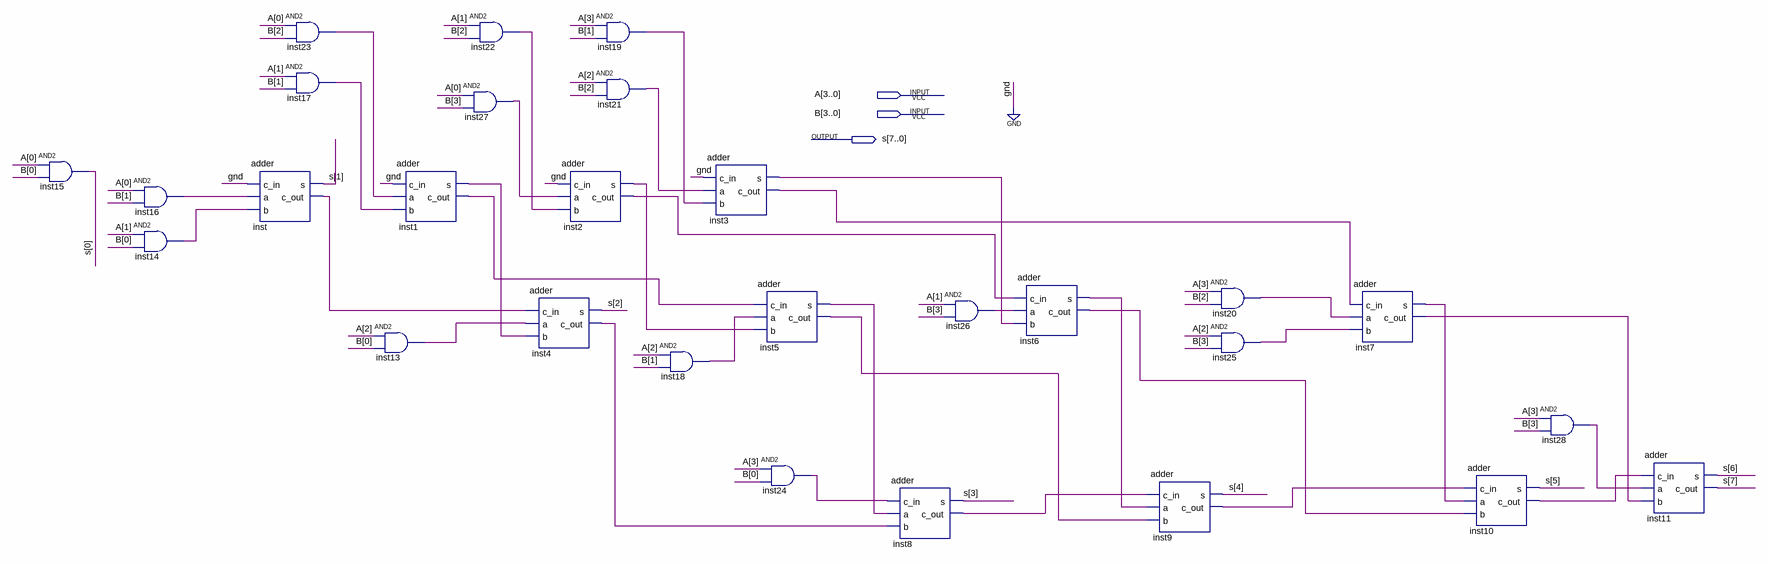
[diagram p0: schematic sheet]
// Quartus schematic multiplier.bdf as structural Verilog: 28 symbols, 3 pins
module multiplier (
  input  [3:0] A,
  input  [3:0] B,
  output [7:0] s
);

  wire inst1_c_out, inst1_s, inst2_c_out, inst2_s, inst3_c_out, inst3_s, inst4_c_out, inst5_c_out, inst5_s,
       inst6_c_out, inst6_s, inst7_c_out, inst7_s, inst8_c_out, inst9_c_out, inst10_c_out, inst13_out,
       inst14_out, inst16_out, inst17_out, inst18_out, inst19_out, inst20_out, inst21_out, inst22_out,
       inst23_out, inst24_out, inst25_out, inst26_out, inst27_out, inst28_out, inst_c_out;

  and inst15 (s[0], A[0], B[0]);
  and inst16 (inst16_out, A[0], B[1]);
  and inst14 (inst14_out, A[1], B[0]);
  adder inst (.c_in(1'b0), .a(inst16_out), .b(inst14_out), .s(s[1]), .c_out(inst_c_out));
  and inst23 (inst23_out, A[0], B[2]);
  and inst17 (inst17_out, A[1], B[1]);
  adder inst1 (.c_in(1'b0), .a(inst23_out), .b(inst17_out), .s(inst1_s), .c_out(inst1_c_out));
  and inst13 (inst13_out, A[2], B[0]);
  and inst22 (inst22_out, A[1], B[2]);
  and inst27 (inst27_out, A[0], B[3]);
  adder inst2 (.c_in(1'b0), .a(inst27_out), .b(inst22_out), .s(inst2_s), .c_out(inst2_c_out));
  adder inst4 (.c_in(inst_c_out), .a(inst13_out), .b(inst1_s), .s(s[2]), .c_out(inst4_c_out));
  and inst19 (inst19_out, A[3], B[1]);
  and inst21 (inst21_out, A[2], B[2]);
  and inst18 (inst18_out, A[2], B[1]);
  adder inst3 (.c_in(1'b0), .a(inst21_out), .b(inst19_out), .s(inst3_s), .c_out(inst3_c_out));
  adder inst5 (.c_in(inst1_c_out), .a(inst18_out), .b(inst2_s), .s(inst5_s), .c_out(inst5_c_out));
  and inst24 (inst24_out, A[3], B[0]);
  adder inst8 (.c_in(inst24_out), .a(inst5_s), .b(inst4_c_out), .s(s[3]), .c_out(inst8_c_out));
  and inst26 (inst26_out, A[1], B[3]);
  adder inst6 (.c_in(inst2_c_out), .a(inst26_out), .b(inst3_s), .s(inst6_s), .c_out(inst6_c_out));
  adder inst9 (.c_in(inst8_c_out), .a(inst6_s), .b(inst5_c_out), .s(s[4]), .c_out(inst9_c_out));
  and inst20 (inst20_out, A[3], B[2]);
  and inst25 (inst25_out, A[2], B[3]);
  adder inst7 (.c_in(inst3_c_out), .a(inst20_out), .b(inst25_out), .s(inst7_s), .c_out(inst7_c_out));
  adder inst10 (.c_in(inst9_c_out), .a(inst7_s), .b(inst6_c_out), .s(s[5]), .c_out(inst10_c_out));
  and inst28 (inst28_out, A[3], B[3]);
  adder inst11 (.c_in(inst10_c_out), .a(inst28_out), .b(inst7_c_out), .s(s[6]), .c_out(s[7]));
endmodule
